# Altium schematic sheet Turbine_SM.SchDoc
size A4
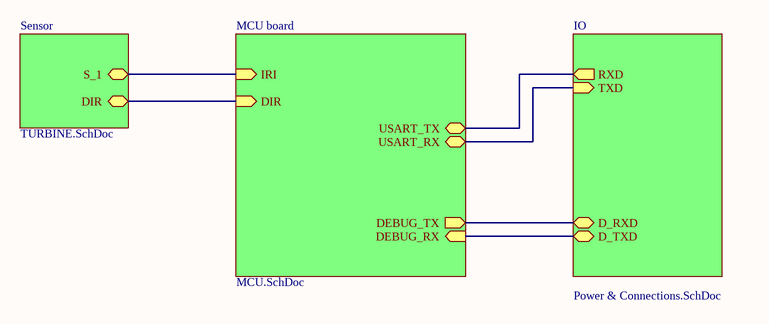
[diagram p0: Turbine_SM.SchDoc]

## Sub-sheets
IO = Power & Connections.SchDoc: TXD (in), RXD (out), D_RXD, D_TXD
MCU board = MCU.SchDoc: IRI (in), DIR (in), DEBUG_TX (out), DEBUG_RX (in), USART_TX, USART_RX
Sensor = TURBINE.SchDoc: S_1, DIR

## Nets
(unnamed): sheet Sensor/S_1, sheet MCU board/IRI
(unnamed): sheet Sensor/DIR, sheet MCU board/DIR
(unnamed): sheet MCU board/DEBUG_TX, sheet IO/D_RXD
(unnamed): sheet MCU board/DEBUG_RX, sheet IO/D_TXD
(unnamed): sheet MCU board/USART_TX, sheet IO/RXD
(unnamed): sheet MCU board/USART_RX, sheet IO/TXD